# Altium schematic sheet Power.SchDoc: Title (part 1 of 3)
size A3; CheckedBy: -; CompanyName: CERN; DrawnBy: DrawnBy; Organization: STM; Address1: European Organization for Nuclear Research; Address2: CH-1211 Genève 23 - Switzerland; Revision: -; SheetNumber: -; SheetTotal: -; EDA_Number: EDA-XXXXX-VX-X; Projet: -; ModifiedBy: -; CreateDate: XX/XX/XXXX; CheckedDate: -; Title2: Title2; DivGrp: TE/MPE; Designer: Designer; ModifiedDate: -
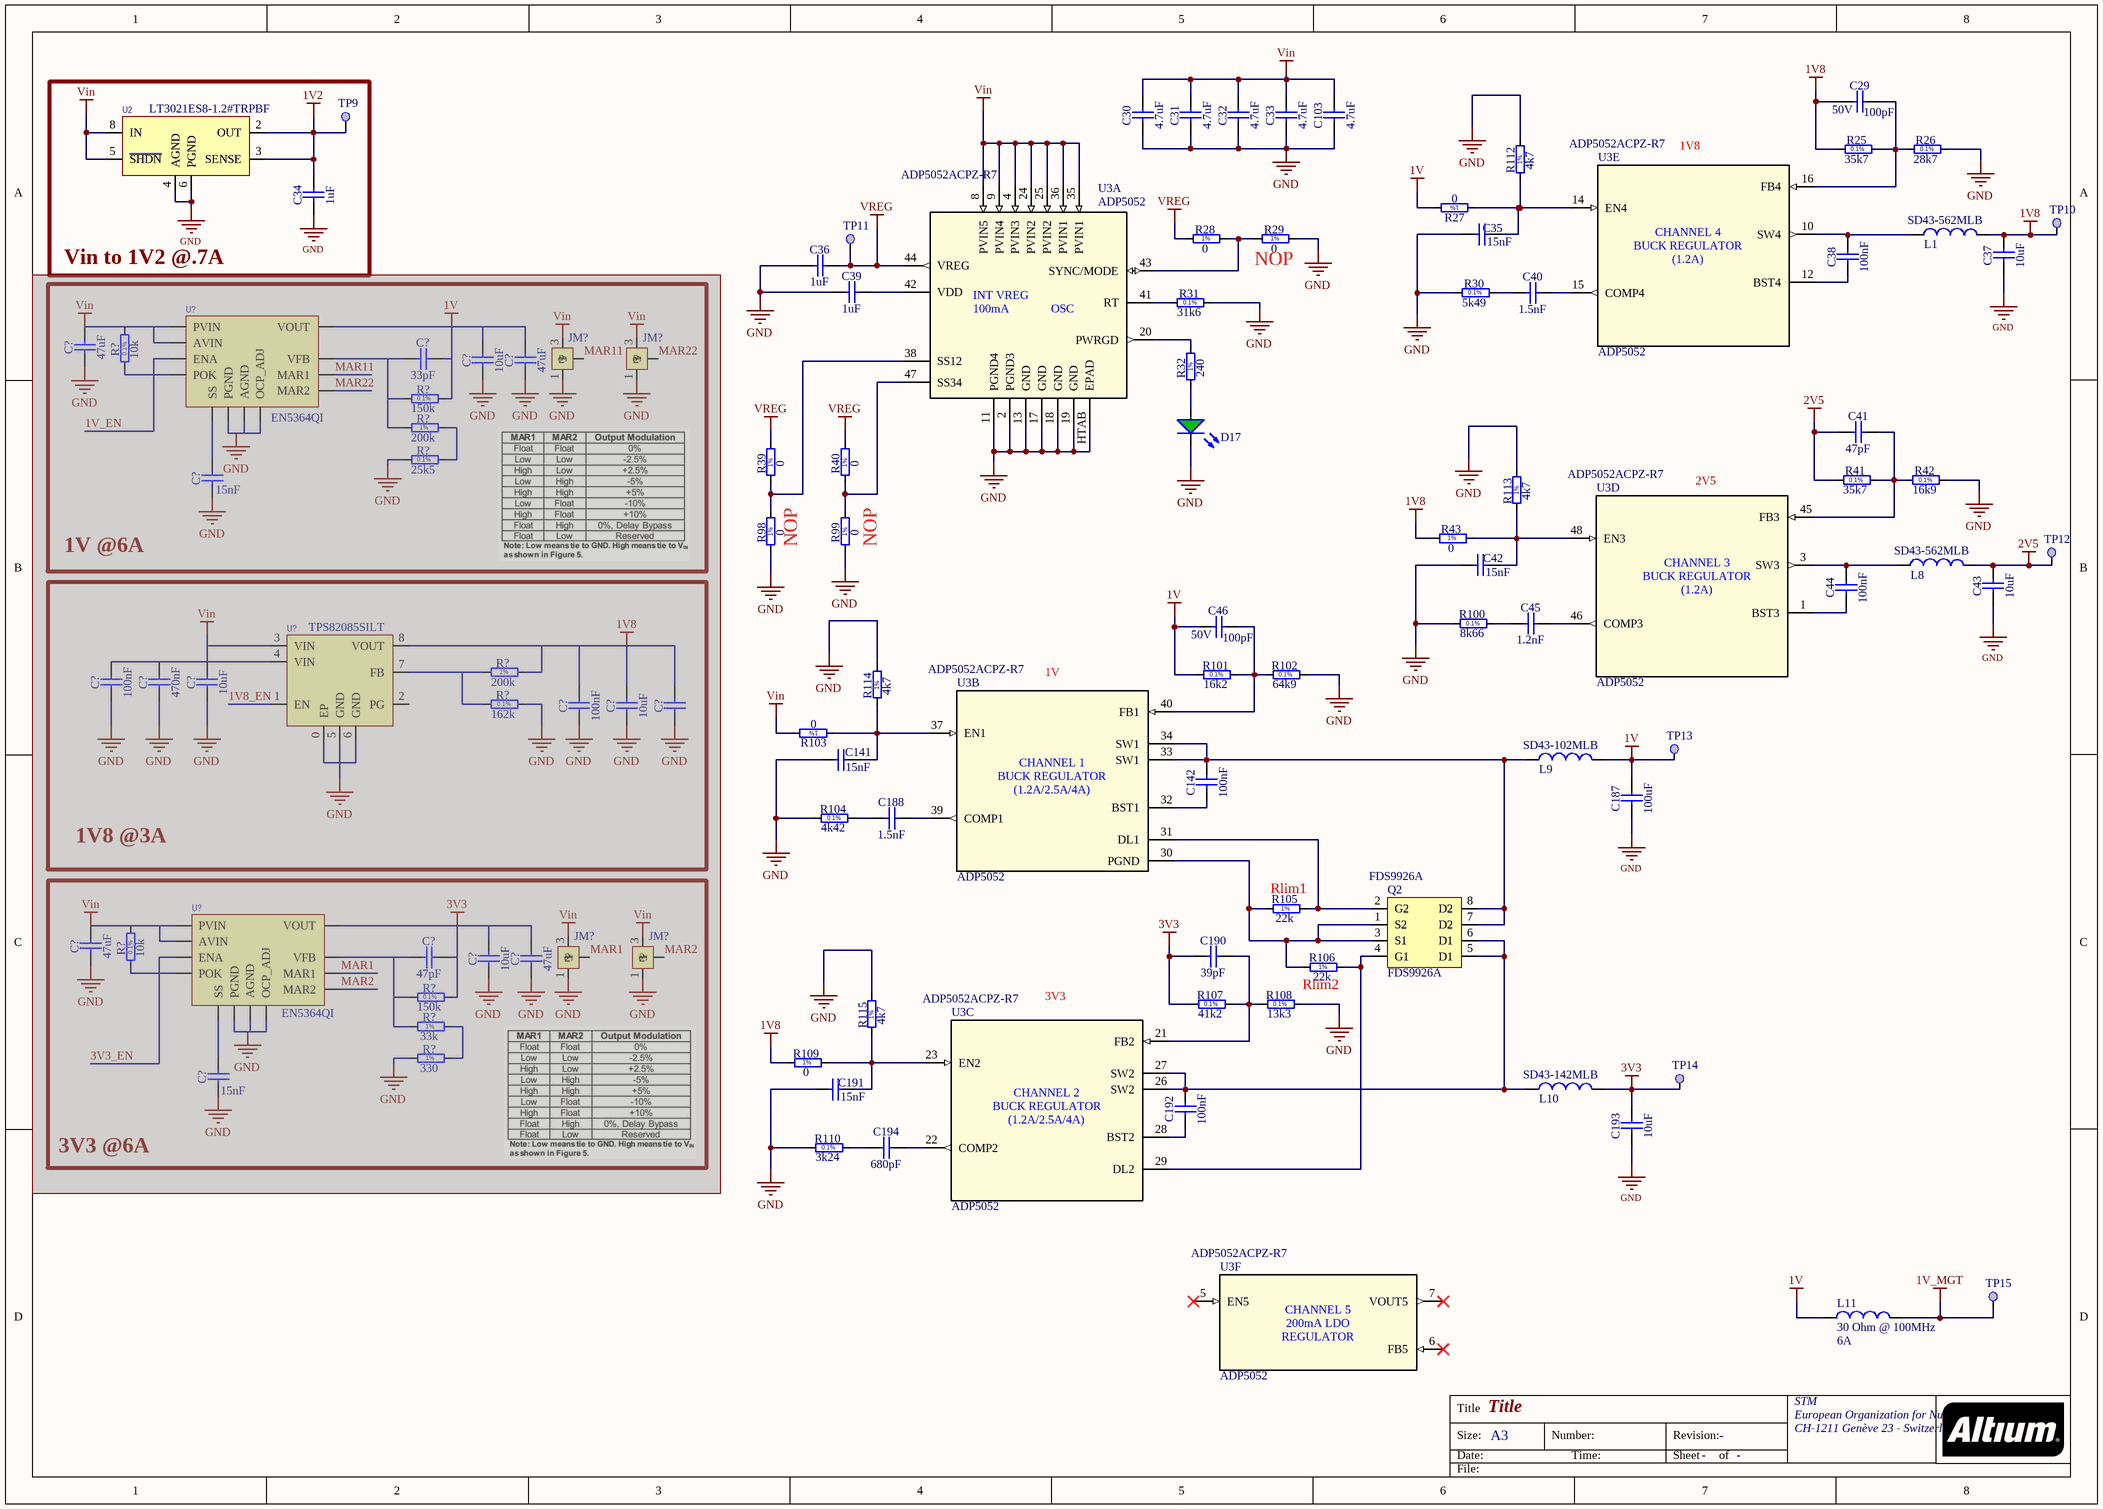
[diagram p0: Power.SchDoc]

## Parts
(Parts that share a designator on the sheet are numbered #1, #2 ... from top to bottom, then left to right.)
C29  100pF  Voltage: 50V  [CAPC1608X87N]
C30  4.7uF  [CAPC2012X135N]
C31  4.7uF  [CAPC2012X135N]
C32  4.7uF  [CAPC2012X135N]
C33  4.7uF  [CAPC2012X135N]
C34  1uF  [CAPC1608X87N]
C35  15nF  [CAPC1608X87N]
C36  1uF  [CAPC1608X87N]
C37  10uF  [CAPC3216X140N]
C38  100nF  [CAPC1608X87N]
C39  1uF  [CAPC1608X87N]
C40  1.5nF  [CAPC1608X87N]
C41  47pF  [CAPC1608X87N]
C42  15nF  [CAPC1608X87N]
C43  10uF  [CAPC3216X140N]
C44  100nF  [CAPC1608X87N]
C45  1.2nF  [CAPC1608X85N]
C46  100pF  Voltage: 50V  [CAPC1608X87N]
C103  4.7uF  [CAPC2012X135N]
C141  15nF  [CAPC1608X87N]
C142  100nF  [CAPC1608X87N]
C187  100uF  [CAPC3225X270N]
C188  1.5nF  [CAPC1608X87N]
C190  39pF  [CAPC1608X87N]
C191  15nF  [CAPC1608X87N]
C192  100nF  [CAPC1608X87N]
C193  10uF  [CAPC3216X140N]
C194  680pF  [CAPC1608X87N]
C?#1  33pF  [CAPC1608X87N]  (masked out: inside a compile mask, not in the netlist)
C?#2  47uF  [CAPC3225X270N]  (masked out: inside a compile mask, not in the netlist)
C?#3  10uF  [CAPC2012X135N]  (masked out: inside a compile mask, not in the netlist)
C?#4  47uF  [CAPC3225X270N]  (masked out: inside a compile mask, not in the netlist)
C?#5  15nF  [CAPC1608X87N]  (masked out: inside a compile mask, not in the netlist)
C?#6  100nF  [CAPC1608X87N]  (masked out: inside a compile mask, not in the netlist)
C?#7  470nF  [CAPC1608X87N]  (masked out: inside a compile mask, not in the netlist)
C?#8  10uF  [CAPC2012X135N]  (masked out: inside a compile mask, not in the netlist)
C?#9  100nF  [CAPC1608X87N]  (masked out: inside a compile mask, not in the netlist)
C?#10  10uF  [CAPC1608X87N]  (masked out: inside a compile mask, not in the netlist)
C?#11  22uF  [CAPC2012X135N]  (value not drawn)  (masked out: inside a compile mask, not in the netlist)
C?#12  47pF  [CAPC1608X87N]  (masked out: inside a compile mask, not in the netlist)
C?#13  47uF  [CAPC3225X270N]  (masked out: inside a compile mask, not in the netlist)
C?#14  10uF  [CAPC2012X135N]  (masked out: inside a compile mask, not in the netlist)
C?#15  47uF  [CAPC3225X270N]  (masked out: inside a compile mask, not in the netlist)
C?#16  15nF  [CAPC1608X87N]  (masked out: inside a compile mask, not in the netlist)
D17  LED0603  [LED0603]  (value not drawn)
JM?#1  Jumper 0R  [JUMPER_0R]  (value not drawn)  (masked out: inside a compile mask, not in the netlist)
JM?#2  Jumper 0R  [JUMPER_0R]  (value not drawn)  (masked out: inside a compile mask, not in the netlist)
JM?#3  Jumper 0R  [JUMPER_0R]  (value not drawn)  (masked out: inside a compile mask, not in the netlist)
JM?#4  Jumper 0R  [JUMPER_0R]  (value not drawn)  (masked out: inside a compile mask, not in the netlist)
L1  Manufacturer Part Number: SD43-562MLB  [sd43]  (hidden comment: SD43)
L8  Manufacturer Part Number: SD43-562MLB  [sd43]  (hidden comment: SD43)
L9  Manufacturer Part Number: SD43-102MLB  [sd43]  (hidden comment: SD43)
L10  Manufacturer Part Number: SD43-142MLB  [sd43]  (hidden comment: SD43)
L11  Impedance @ Frequency: 30 Ohm @ 100MHz  Current Rating: 6A  [R0805]  (hidden comment: 3.6uH, 12.5A)
Q2  FDS9926A  [SO8]
R25  35k7  [RESC1608X55N]
R26  28k7  [RESC1608X55N]
R27  0  [RESC1608X55N]
R28  0  [RESC1608X55N]
R29  0  [RESC1608X55N]
R30  5k49  [RESC1608X55N]
R31  31k6  [RESC1608X55N]
R32  240  [RESC1608X55N]
R39  0  [RESC1608X55N]
R40  0  [RESC1608X55N]
R41  35k7  [RESC1608X55N]
R42  16k9  [RESC1608X55N]
R43  0  [RESC1608X55N]
R98  0  [RESC1608X55N]
R99  0  [RESC1608X55N]
R100  8k66  [RESC1608X55N]
R101  16k2  [RESC1608X55N]
R102  64k9  [RESC1608X55N]
R103  0  [RESC1608X55N]
R104  4k42  [RESC1608X55N]
R105  22k  [RESC1608X55N]
R106  22k  [RESC1608X55N]
R107  41k2  [RESC1608X55N]
R108  13k3  [RESC1608X55N]
R109  0  [RESC1608X55N]
R110  3k24  [RESC1608X55N]
R112  4k7  [RESC1608X55N]
R113  4k7  [RESC1608X55N]
R114  4k7  [RESC1608X55N]
R115  4k7  [RESC1608X55N]
R?#1  10k  [RESC1608X55N]  (masked out: inside a compile mask, not in the netlist)
R?#2  150k  [RESC1608X55N]  (masked out: inside a compile mask, not in the netlist)
R?#3  200k  [RESC1608X55N]  (masked out: inside a compile mask, not in the netlist)
R?#4  25k5  [RESC1608X55N]  (masked out: inside a compile mask, not in the netlist)
R?#5  200k  [RESC1608X55N]  (masked out: inside a compile mask, not in the netlist)
R?#6  162k  [RESC2012X60N]  (masked out: inside a compile mask, not in the netlist)
R?#7  10k  [RESC1608X55N]  (masked out: inside a compile mask, not in the netlist)
R?#8  150k  [RESC1608X55N]  (masked out: inside a compile mask, not in the netlist)
R?#9  33k  [RESC1608X55N]  (masked out: inside a compile mask, not in the netlist)
R?#10  330  [RESC1608X55N]  (masked out: inside a compile mask, not in the netlist)
TP9  TP  [TP]  (value not drawn)  (no BOM)
TP10  TP  [TP]  (value not drawn)  (no BOM)
TP11  TP  [TP]  (value not drawn)  (no BOM)
TP12  TP  [TP]  (value not drawn)  (no BOM)
TP13  TP  [TP]  (value not drawn)  (no BOM)
TP14  TP  [TP]  (value not drawn)  (no BOM)
TP15  TP  [TP]  (value not drawn)  (no BOM)
U2  Manufacturer Part Number: LT3021ES8-1.2#TRPBF  [SO8]  (hidden comment: LT3021-1.2)
U3  ADP5052  [CP-48-13_M]  (parts A,B,C,D,E,F of 6)
U?#1  EN5364QI  [EN5364QI]  (masked out: inside a compile mask, not in the netlist)
U?#2  TPS82085SILT  [uSIP]  (masked out: inside a compile mask, not in the netlist)
U?#3  EN5364QI  [EN5364QI]  (masked out: inside a compile mask, not in the netlist)

## Blocks framed on the sheet
Vin to 1V2 @.7A: C34 TP9 U2
1V @6A: C?#1-C?#5 JM?#1 JM?#2 R?#1-R?#4 U?#1
1V8 @3A: C?#6-C?#11 R?#5 R?#6 U?#2
3V3 @6A: C?#12-C?#16 JM?#3 JM?#4 R?#7-R?#10 U?#3

## Nets
1V: C46.1 C187.2 L9.2 L11.1 R27.2 R101.1 TP13.1
1V2: C34.2 TP9.1 U2.2(OUT) U2.3(SENSE)
1V8: C29.1 C37.2 L1.2 R25.1 R43.1 R109.1 TP10.1
1V_MGT: L11.2 TP15.1
2V5: C41.1 C43.2 L8.2 R41.1 TP12.1
3V3: C190.1 C193.2 L10.2 R107.1 TP14.1
GND: C30.1 C31.1 C32.1 C33.1 C34.1 C35.1 C36.1 C37.1 C39.1 C42.1 C43.1 C103.1 C141.1 C187.1 C191.1 C193.1 D17.K R26.2 R29.2 R30.1 R31.2 R42.2 R98.1 R99.1 R100.1 R102.2 R104.1 R108.2 R110.1 R112.2 R113.2 R114.2 R115.2 U2.4(AGND) U2.6(PGND) U3.2(PGND3) U3.11(PGND4) U3.13(GND) U3.17(GND) U3.18(GND) U3.19(GND) U3.HTAB(EPAD)
Vin: C30.2 C31.2 C32.2 C33.2 C103.2 R103.2 U2.5(NC) U2.8(IN) U3.4(PVIN3) U3.8(PVIN5) U3.9(PVIN4) U3.24(PVIN2) U3.25(PVIN2) U3.35(PVIN1) U3.36(PVIN1)
VREG: C36.2 R28.1 R39.2 R40.2 TP11.1 U3.44(VREG)
NetC29_2: C29.2 R25.2 R26.1 U3.16(FB4)
NetC35_2: C35.2 R27.1 R112.1 U3.14(EN4)
NetC38_1: C38.1 U3.12(BST4)
NetC38_2: C38.2 L1.1 U3.10(SW4)
NetC39_2: C39.2 U3.42(VDD)
NetC40_1: C40.1 R30.2
NetC40_2: C40.2 U3.15(COMP4)
NetC41_2: C41.2 R41.2 R42.1 U3.45(FB3)
NetC42_2: C42.2 R43.2 R113.1 U3.48(EN3)
NetC44_1: C44.1 U3.1(BST3)
NetC44_2: C44.2 L8.1 U3.3(SW3)
NetC45_1: C45.1 R100.2
NetC45_2: C45.2 U3.46(COMP3)
NetC46_2: C46.2 R101.2 R102.1 U3.40(FB1)
NetC141_2: C141.2 R103.1 R114.1 U3.37(EN1)
NetC142_1: C142.1 U3.32(BST1)
NetC142_2: C142.2 L9.1 Q2.7(D2) Q2.8(D2) U3.33(SW1) U3.34(SW1)
NetC188_1: C188.1 R104.2
NetC188_2: C188.2 U3.39(COMP1)
NetC190_2: C190.2 R107.2 R108.1 U3.21(FB2)
NetC191_2: C191.2 R109.2 R115.1 U3.23(EN2)
NetC192_1: C192.1 U3.28(BST2)
NetC192_2: C192.2 L10.1 Q2.5(D1) Q2.6(D1) U3.26(SW2) U3.27(SW2)
NetC194_1: C194.1 R110.2
NetC194_2: C194.2 U3.22(COMP2)
NetD17_A: D17.A R32.1
NetQ2_1: Q2.1(S2) Q2.3(S1) R105.1 R106.1 U3.30(PGND)
NetQ2_2: Q2.2(G2) R105.2 U3.31(DL1)
NetQ2_4: Q2.4(G1) R106.2 U3.29(DL2)
NetR28_2: R28.2 R29.1 U3.43(SYNC/MODE)
NetR31_1: R31.1 U3.41(RT)
NetR32_2: R32.2 U3.20(PWRGD)
NetR39_1: R39.1 R98.2 U3.38(SS12)
NetR40_1: R40.1 R99.2 U3.47(SS34)

Not connected (* = marked no-connect by the designer): U3 5(EN5)* 6(FB5)* 7(VOUT5)*

## Notes on the sheet
- (near U3) 1V8
- (near R29) NOP
- (near U3) 2V5
- (near R98) NOP
- (near R99) NOP
- (near U3) 1V
- (near R105) Rlim1
- Rlim2
- (near U3) 3V3
- Title
- Size:
- Date:
- A3
- Number:
- Time:
- Revision:
- Sheet
- of
- File:
- (in symbol ADP5052ACPZ-R7, part A) INT VREG / 100mA              OSC
- (in symbol ADP5052ACPZ-R7, part B) CHANNEL 1 / BUCK REGULATOR / (1.2A/2.5A/4A)
- (in symbol ADP5052ACPZ-R7, part C) CHANNEL 2 / BUCK REGULATOR / (1.2A/2.5A/4A)
- (in symbol ADP5052ACPZ-R7, part D) CHANNEL 3 / BUCK REGULATOR / (1.2A)
- (in symbol ADP5052ACPZ-R7, part E) CHANNEL 4 / BUCK REGULATOR / (1.2A)
- (in symbol ADP5052ACPZ-R7, part F) CHANNEL 5 / 200mA LDO / REGULATOR
- (in symbol R0603_0R_JUMPER) 1%
- (in symbol R0603_3K24_0.1%_0.063W_10PPM) 0.1%
- (in symbol R0603_4K7_1%_0.1W_100PPM) 1%
- (in symbol R0603_4K42_0.1%_0.063W_10PPM) 0.1%
- (in symbol R0603_5K49_0.1%_0.063W_10PPM) 0.1%
- (in symbol R0603_8K66_0.1%_0.063W_10PPM) 0.1%
- (in symbol R0603_10K_0.1%_0.063W_10PPM) 0.1%
- (in symbol R0603_10k_0.1%_0.063W_10PPM) 0.1%
- (in symbol R0603_13K3_0.1%_0.063W_10PPM) 0.1%
- (in symbol R0603_16K2_0.1%_0.063W_10PPM) 0.1%
- (in symbol R0603_16K9_0.1%_0.063W_10PPM) 0.1%
- (in symbol R0603_22K_1%_0.1W_100PPM) 1%
- (in symbol R0603_25K5_0.1%_0.063W_10PPM) 0.1%
- (in symbol R0603_28K7_0.1%_0.063W_10PPM) 0.1%
- (in symbol R0603_31K6_0.1%_0.063W_10PPM) 0.1%
- (in symbol R0603_33K_1%_0.1W_100PPM) 1%
- (in symbol R0603_35K7_0.1%_0.063W_10PPM) 0.1%
- (in symbol R0603_41K2_0.1%_0.063W_10PPM) 0.1%
- (in symbol R0603_64K9_0.1%_0.063W_10PPM) 0.1%
- (in symbol R0603_150K_0.1%_0.063W_10PPM) 0.1%
- (in symbol R0603_200K_1%_0.1W_100PPM) 1%
- (in symbol R0603_240R_1%_0.1W_100PPM) 1%
- (in symbol R0603_330R_1%_0.1W_100PPM) 1%
- (in symbol R0805_162K_0.1%_0.125W_25PPM) 0.1%